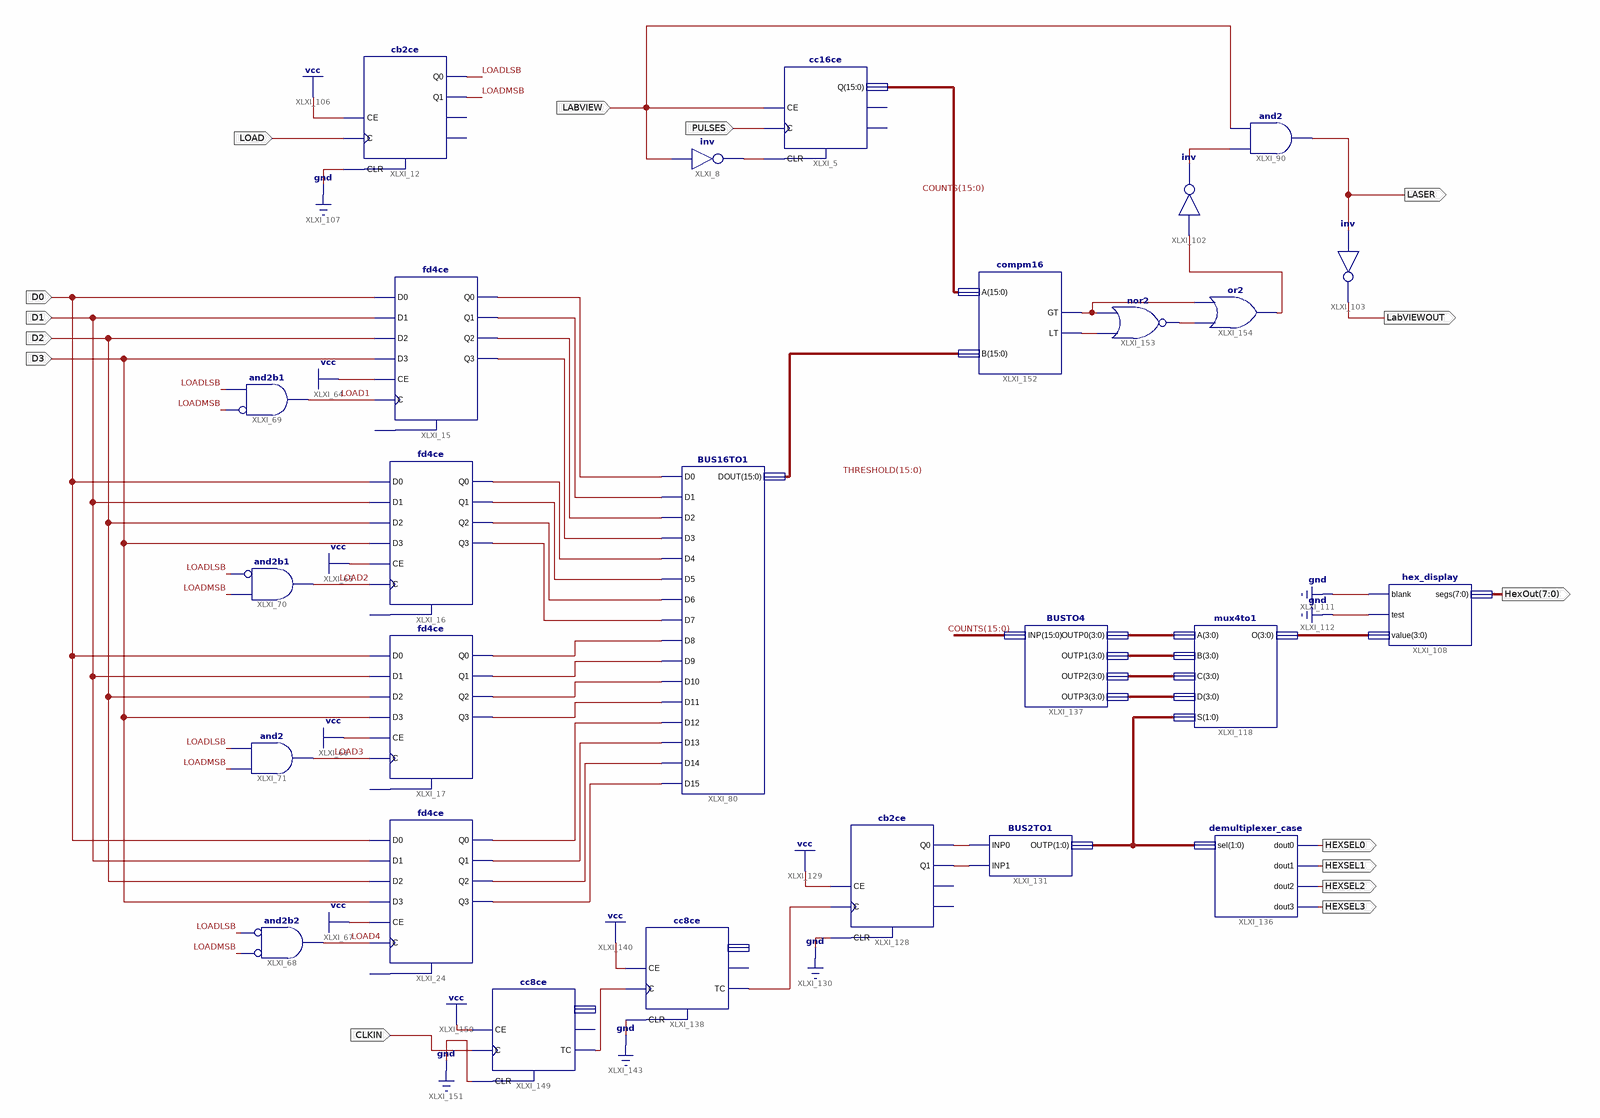
[diagram p0: schematic sheet 1]
// Xilinx ISE schematic MichaelsFPGAVision.sch (spartan3) as structural Verilog: 26 symbols, 15 ports
module MichaelsFPGAVision (
  input  D0,
  input  D1,
  input  D2,
  input  D3,
  input  LABVIEW,
  input  PULSES,
  input  LOAD,
  input  CLKIN,
  output LASER,
  output LabVIEWOUT,
  output [7:0] HexOut,
  output HEXSEL0,
  output HEXSEL1,
  output HEXSEL2,
  output HEXSEL3
);

  wire LOAD1, LOAD2, LOAD3, LOAD4, LOADLSB, LOADMSB, XLXN_7, XLXN_92, XLXN_93, XLXN_94, XLXN_95, XLXN_96,
       XLXN_97, XLXN_98, XLXN_99, XLXN_100, XLXN_101, XLXN_102, XLXN_103, XLXN_104, XLXN_105, XLXN_106,
       XLXN_107, XLXN_141, XLXN_177, XLXN_178, XLXN_184, XLXN_196, XLXN_208, XLXN_220, XLXN_222, XLXN_223;
  wire [1:0] XLXN_179;
  wire [3:0] XLXN_158, XLXN_169, XLXN_170, XLXN_171, XLXN_172;
  wire [15:0] COUNTS, THRESHOLD;

  fd4ce XLXI_15 (
    .C(LOAD1), .CE(1'b1), .D0(D0), .D1(D1), .D2(D2), .D3(D3), .Q0(XLXN_92), .Q1(XLXN_93), .Q2(XLXN_94),
    .Q3(XLXN_95));  // open: CLR
  fd4ce XLXI_16 (
    .C(LOAD2), .CE(1'b1), .D0(D0), .D1(D1), .D2(D2), .D3(D3), .Q0(XLXN_96), .Q1(XLXN_97), .Q2(XLXN_98),
    .Q3(XLXN_99));  // open: CLR
  fd4ce XLXI_17 (
    .C(LOAD3), .CE(1'b1), .D0(D0), .D1(D1), .D2(D2), .D3(D3), .Q0(XLXN_100), .Q1(XLXN_101), .Q2(XLXN_102),
    .Q3(XLXN_103));  // open: CLR
  fd4ce XLXI_24 (
    .C(LOAD4), .CE(1'b1), .D0(D0), .D1(D1), .D2(D2), .D3(D3), .Q0(XLXN_104), .Q1(XLXN_105), .Q2(XLXN_106),
    .Q3(XLXN_107));  // open: CLR
  BUS16TO1 XLXI_80 (
    .D0(XLXN_92), .D1(XLXN_93), .D2(XLXN_94), .D3(XLXN_95), .D4(XLXN_96), .D5(XLXN_97), .D6(XLXN_98),
    .D7(XLXN_99), .D8(XLXN_100), .D9(XLXN_101), .D10(XLXN_102), .D11(XLXN_103), .D12(XLXN_104),
    .D13(XLXN_105), .D14(XLXN_106), .D15(XLXN_107), .DOUT(THRESHOLD));
  not XLXI_8 (XLXN_7, LABVIEW);
  cc16ce XLXI_5 (.C(PULSES), .CE(LABVIEW), .CLR(XLXN_7), .Q(COUNTS));  // open: CEO, TC
  and XLXI_90 (LASER, XLXN_141, LABVIEW);
  and XLXI_69 (LOAD1, ~LOADMSB, LOADLSB);  // and2b1
  and XLXI_71 (LOAD3, LOADMSB, LOADLSB);
  and XLXI_68 (LOAD4, ~LOADMSB, ~LOADLSB);  // and2b2
  and XLXI_70 (LOAD2, ~LOADLSB, LOADMSB);  // and2b1
  not XLXI_102 (XLXN_141, XLXN_223);
  not XLXI_103 (LabVIEWOUT, LASER);
  cb2ce XLXI_12 (.C(LOAD), .CE(1'b1), .CLR(1'b0), .Q0(LOADLSB), .Q1(LOADMSB));  // open: CEO, TC
  hex_display XLXI_108 (.blank(1'b0), .test(1'b0), .value(XLXN_158), .segs(HexOut));
  mux4to1 XLXI_118 (.A(XLXN_169), .B(XLXN_170), .C(XLXN_171), .D(XLXN_172), .S(XLXN_179), .O(XLXN_158));
  cb2ce XLXI_128 (.C(XLXN_184), .CE(1'b1), .CLR(1'b0), .Q0(XLXN_177), .Q1(XLXN_178));  // open: CEO, TC
  BUS2TO1 XLXI_131 (.INP0(XLXN_177), .INP1(XLXN_178), .OUTP(XLXN_179));
  demultiplexer_case XLXI_136 (.sel(XLXN_179), .dout0(HEXSEL0), .dout1(HEXSEL1), .dout2(HEXSEL2), .dout3(HEXSEL3));
  cc8ce XLXI_138 (.C(XLXN_196), .CE(1'b1), .CLR(1'b0), .TC(XLXN_184));  // open: CEO, Q
  BUSTO4 XLXI_137 (.INP(COUNTS), .OUTP0(XLXN_169), .OUTP1(XLXN_170), .OUTP2(XLXN_171), .OUTP3(XLXN_172));
  cc8ce XLXI_149 (.C(CLKIN), .CE(1'b1), .CLR(1'b0), .TC(XLXN_196));  // open: CEO, Q
  compm16 XLXI_152 (.A(COUNTS), .B(THRESHOLD), .GT(XLXN_222), .LT(XLXN_208));
  nor XLXI_153 (XLXN_220, XLXN_208, XLXN_222);
  or XLXI_154 (XLXN_223, XLXN_220, XLXN_222);
endmodule
